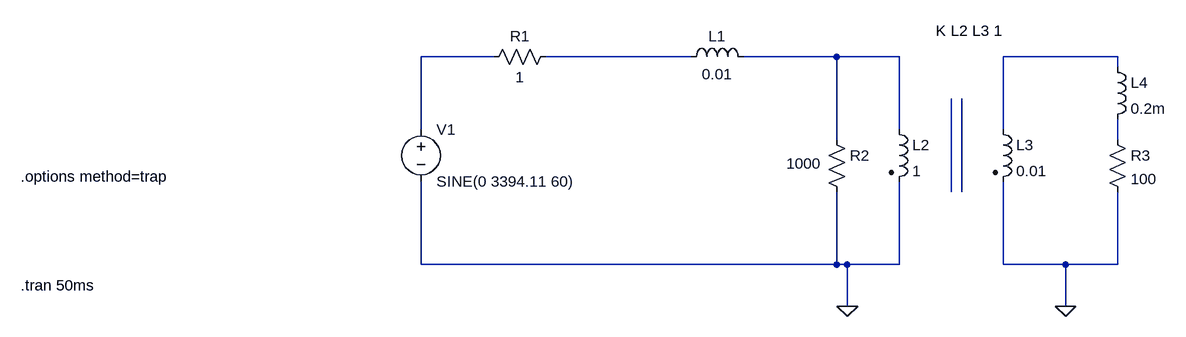
[diagram p0: schematic trafo_single.asc]
trafo_single.asc, the LTspice schematic file:
Version 4
SHEET 1 1208 680
WIRE -16 48 -128 48
WIRE 288 48 64 48
WIRE 512 48 368 48
WIRE 608 48 512 48
WIRE 944 48 768 48
WIRE 944 64 944 48
WIRE -128 160 -128 48
WIRE 608 160 608 48
WIRE 768 160 768 48
WIRE 512 176 512 48
WIRE 944 176 944 144
WIRE 688 256 688 112
WIRE 704 256 704 112
WIRE -128 368 -128 240
WIRE 512 368 512 256
WIRE 512 368 -128 368
WIRE 528 368 512 368
WIRE 608 368 608 240
WIRE 608 368 528 368
WIRE 768 368 768 240
WIRE 864 368 768 368
WIRE 944 368 944 256
WIRE 944 368 864 368
WIRE 528 432 528 368
WIRE 864 432 864 368
FLAG 528 432 0
FLAG 864 432 0
SYMBOL res -32 64 R270
WINDOW 0 32 56 VTop 2
WINDOW 3 0 56 VBottom 2
SYMATTR InstName R1
SYMATTR Value 1
SYMBOL ind 272 64 R270
WINDOW 0 32 56 VTop 2
WINDOW 3 5 56 VBottom 2
SYMATTR InstName L1
SYMATTR Value 0.01
SYMBOL voltage -128 144 R0
WINDOW 123 0 0 Left 0
WINDOW 39 0 0 Left 0
SYMATTR InstName V1
SYMATTR Value SINE(0 3394.11 60)
SYMBOL res 496 160 R0
WINDOW 3 -62 52 Left 2
SYMATTR InstName R2
SYMATTR Value 1000
SYMBOL res 928 160 R0
SYMATTR InstName R3
SYMATTR Value 100
SYMBOL ind2 592 144 R0
SYMATTR InstName L2
SYMATTR Value 1
SYMATTR Type ind
SYMBOL ind2 752 144 R0
SYMATTR InstName L3
SYMATTR Value 0.01
SYMATTR Type ind
SYMBOL ind 928 48 R0
SYMATTR InstName L4
SYMATTR Value 0.2m
TEXT -744 400 Left 2 !.tran 50ms
TEXT 664 8 Left 2 !K L2 L3 1
TEXT -744 232 Left 2 !.options method=trap

The netlist it stands for:
* trafo_single.asc
R1 N001 N002 1
L1 N002 N003 0.01
V1 N001 0 SINE(0 3394.11 60)
R2 N003 0 1000
R3 N005 0 100
L2 N003 0 1
L3 N004 0 0.01
L4 N004 N005 0.2m
.tran 50ms
K L2 L3 1
.options method=trap
.backanno
.end